# EAGLE design Minimal_carrier_board_for_CM4_rev_A (EAGLE 9.6.2)
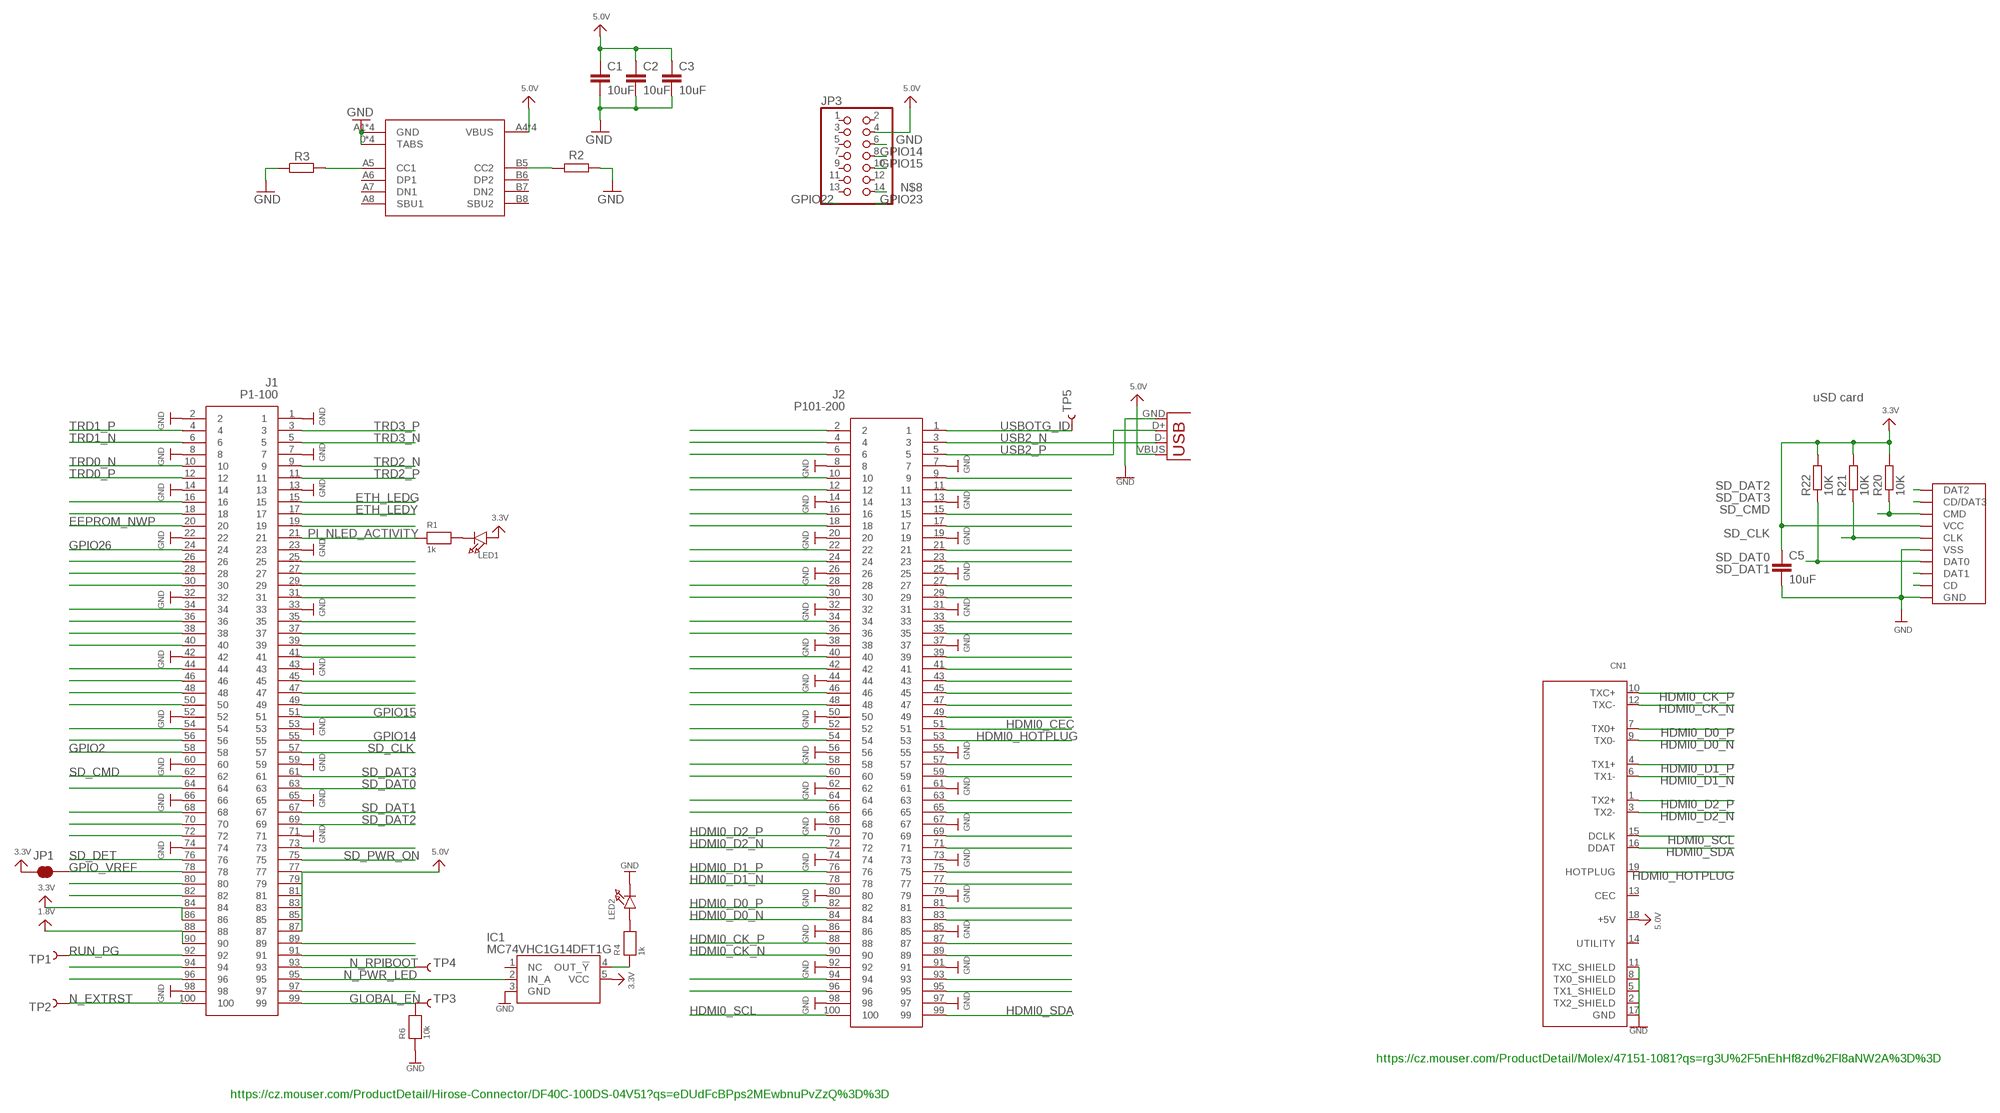
[diagram p0: schematic, sheet 1]

## Parts
C1  10uF  C-EUC0805  [C0805]
C2  10uF  C-EUC0805  [C0805]
C3  10uF  C-EUC0805  [C0805]
C5  10uF  C-EUC0805  [C0805]
CN1  HDMI_MOLEX_47151-0001  [HDMI_MOLEX_47151-0001]
IC1  MC74VHC1G14DFT1G  [SOT65P210X110-5N]
J1  P1-100  DF40C-100DS-0.4V_51_  [DF40C100DS04V51]
J2  P101-200  DF40C-100DS-0.4V_51_  [DF40C100DS04V51]
JP1  JUMPER-SMT_2_NC_TRACE_NO-SILK  [SMT-JUMPER_2_NC_TRACE_NO-SILK]
JP3  PINHD-2X7  [2X07]
LED1  LED0805_NOOUTLINE  [CHIPLED_0805_NOOUTLINE]
LED2  LED0805_NOOUTLINE  [CHIPLED_0805_NOOUTLINE]
R1  1k  RESISTOR_0805MP  [_0805MP]
R2  5.1k  R-EU_R0805  [R0805]
R3  5.1k  R-EU_R0805  [R0805]
R4  1k  RESISTOR_0805MP  [_0805MP]
R6  10k  RESISTOR_0805MP  [_0805MP]
R20  10K  R-EU_R0805  [R0805]
R21  10K  R-EU_R0805  [R0805]
R22  10K  R-EU_R0805  [R0805]
SD_CARD  MICRO_SD_CARD_  [TFP09-2--12B]
TP1  TEST-POINT3X5  [PAD.03X.05]
TP2  TEST-POINT3X5  [PAD.03X.05]
TP3  TEST-POINT3X5  [PAD.03X.05]
TP4  TEST-POINT3X5  [PAD.03X.05]
TP5  TEST-POINT3X5  [PAD.03X.05]
U$59  TYPE-C-31-M-12  [USB-TYPE-C_16PIN-MALE-TYPE-C-31-M-12]
USB2  USBA-PTH  [USB-A-F-PTH]

## Nets
1.8V: J1.88 J1.90
3.3V: C5.1 IC1.5(VCC) J1.84 J1.86 JP1.1 LED1.A R20.2 R21.2 R22.2 SD_CARD.VCC
5.0V: C1.1 C2.1 C3.1 CN1.18(+5V) J1.77 J1.79 J1.81 J1.83 J1.85 J1.87 JP3.4 U$59.A4(VBUS) U$59.A9(VBUS) U$59.B4(VBUS) U$59.B9(VBUS) USB2.VBUS
A0/CC2: R3.2 U$59.A5(CC1)
A3/CC1: R2.1 U$59.B5(CC2)
EEPROM_NWP: J1.20
ETH_LEDG: J1.15
ETH_LEDY: J1.17
GLOBAL_EN: J1.99 R6.2 TP3.P$1
GND: C1.2 C2.2 C3.2 C5.2 CN1.2(TX2_SHIELD) CN1.5(TX1_SHIELD) CN1.8(TX0_SHIELD) CN1.11(TXC_SHIELD) CN1.17(GND) IC1.3(GND) J1.1 J1.2 J1.7 J1.8 J1.13 J1.14 J1.22 J1.23 J1.32 J1.33 J1.42 J1.43 J1.52 J1.53 J1.59 J1.60 J1.65 J1.66 J1.71 J1.74 J1.98 J2.7 J2.8 J2.13 J2.14 J2.19 J2.20 J2.25 J2.26 J2.31 J2.32 J2.37 J2.38 J2.44 J2.50 J2.55 J2.56 J2.61 J2.62 J2.67 J2.68 J2.73 J2.74 J2.79 J2.80 J2.85 J2.86 J2.91 J2.92 J2.97 J2.98 JP3.6 LED2.C R2.2 R3.1 R6.1 SD_CARD.GND SD_CARD.GND@1(GND) SD_CARD.GND@2(GND) SD_CARD.GND@3(VSS) SD_CARD.VSS(GND) U$59.0(TABS) U$59.0-1(TABS) U$59.0-2(TABS) U$59.0-3(TABS) U$59.A1(GND) U$59.A12(GND) U$59.B1(GND) U$59.B12(GND) USB2.GND
GPIO2: J1.58
GPIO14: J1.55 JP3.8
GPIO15: J1.51 JP3.10
GPIO26: J1.24
GPIO_VREF: J1.78 JP1.2
HDMI0_CEC: J2.51
HDMI0_CK_N [diff_pairs]: CN1.12(TXC-) J2.90
HDMI0_CK_P [diff_pairs]: CN1.10(TXC+) J2.88
HDMI0_D0_N [diff_pairs]: CN1.9(TX0-) J2.84
HDMI0_D0_P [diff_pairs]: CN1.7(TX0+) J2.82
HDMI0_D1_N [diff_pairs]: CN1.6(TX1-) J2.78
HDMI0_D1_P [diff_pairs]: CN1.4(TX1+) J2.76
HDMI0_D2_N [diff_pairs]: CN1.3(TX2-) J2.72
HDMI0_D2_P [diff_pairs]: CN1.1(TX2+) J2.70
HDMI0_HOTPLUG: CN1.19(HOTPLUG) J2.53
HDMI0_SCL: CN1.15(DCLK) J2.100
HDMI0_SDA: CN1.16(DDAT) J2.99
N$1: LED1.C R1.2
N$3: J2.2
N$4: IC1.4(OUT_!Y) R4.1
N$5: J2.4
N$6: LED2.A R4.2
N$7: J2.6
N$8: JP3.14
N$9: SD_CARD.CD
N$10: J2.9
N$11: J2.10
N$12: J2.11
N$13: J2.12
N$16: J1.16
N$17: J2.15
N$18: J1.18
N$19: J1.19
N$20: J2.16
N$21: J2.17
N$22: J2.18
N$25: J1.25
N$26: J1.26
N$27: J1.27
N$28: J1.28
N$29: J1.29
N$30: J1.30
N$31: J1.31
N$32: J2.21
N$33: J2.22
N$34: J1.34
N$35: J1.35
N$36: J1.36
N$37: J1.37
N$38: J1.38
N$39: J1.39
N$40: J1.40
N$41: J1.41
N$42: J2.23
N$43: J2.24
N$44: J1.44
N$45: J1.45
N$46: J1.46
N$47: J1.47
N$48: J1.48
N$49: J1.49
N$50: J1.50
N$54: J1.54
N$56: J1.56
N$57: J2.27
N$58: J2.28
N$59: J2.29
N$60: J2.30
N$63: J2.33
N$64: J1.64
N$65: J2.34
N$66: J2.35
N$67: J2.36
N$68: J1.68
N$70: J1.70
N$72: J1.72
N$73: J1.73
N$74: J2.39
N$75: J2.40
N$76: J2.41
N$77: J2.42
N$78: J2.43
N$80: J1.80
N$81: J2.45
N$82: J1.82
N$83: J2.46
N$84: J2.47
N$85: J2.48
N$86: J2.49
N$89: J1.89
N$90: J2.52
N$91: J1.91
N$93: J2.54
N$94: J1.94
N$96: J1.96
N$97: J1.97
N$99: J2.57
N$100: J2.58
N$101: J2.59
N$102: J2.60
N$105: J2.63
N$106: J2.64
N$107: J2.65
N$108: J2.66
N$111: J2.69
N$113: J2.71
N$117: J2.75
N$119: J2.77
N$123: J2.81
N$125: J2.83
N$129: J2.87
N$131: J2.89
N$135: J2.93
N$136: J2.94
N$137: J2.95
N$138: J2.96
N_EXTRST: J1.100 TP2.P$1
N_PWR_LED: IC1.2(IN_A) J1.95
N_RPIBOOT: J1.93 TP4.P$1
PI_NLED_ACTIVITY: J1.21 R1.1
RUN_PG: J1.92 TP1.P$1
SD_CLK: J1.57 R21.1 SD_CARD.CLK
SD_CMD: J1.62 R20.1 SD_CARD.CMD
SD_DAT0: J1.63 R22.1 SD_CARD.DAT0
SD_DAT1: J1.67 SD_CARD.DAT1
SD_DAT2: J1.69 SD_CARD.DAT2
SD_DAT3: J1.61 SD_CARD.CD/DAT3
SD_DET: J1.76
SD_PWR_ON: J1.75
TRD0_N: J1.10
TRD0_P: J1.12
TRD1_N: J1.6
TRD1_P: J1.4
TRD2_N: J1.9
TRD2_P: J1.11
TRD3_N: J1.5
TRD3_P: J1.3
USB2_N [diff_pairs]: J2.3 USB2.D-
USB2_P [diff_pairs]: J2.5 USB2.D+
USBOTG_ID: J2.1 TP5.P$1
Unconnected: CN1.13(CEC) CN1.14(UTILITY) IC1.1(NC) JP3.1 JP3.2 JP3.3 JP3.5 JP3.7 JP3.9 JP3.11 JP3.12 JP3.13 U$59.A6(DP1) U$59.A7(DN1) U$59.A8(SBU1) U$59.B6(DP2) U$59.B7(DN2) U$59.B8(SBU2)

## Notes on the sheet
- uSD card
- https://cz.mouser.com/ProductDetail/Molex/47151-1081?qs=rg3U%2F5nEhHf8zd%2FI8aNW2A%3D%3D
- https://cz.mouser.com/ProductDetail/Hirose-Connector/DF40C-100DS-04V51?qs=eDUdFcBPps2MEwbnuPvZzQ%3D%3D

## Power pins joined to a net without a drawn wire
GND: CN1.P$1(GND) CN1.P$2(GND) CN1.P$3(GND) CN1.P$4(GND)

## Library data of the parts
C1-C3 C5 = rcl:C-EU: CAPACITOR, European symbol; SPICEPREFIX: C
CN1 = microbuilder:HDMI_MOLEX_47151-0001
IC1 = SamacSys_Parts:MC74VHC1G14DFT1G: Source: Datasheet <http://www.onsemi.com/pub/Collateral/MC74VHC1G14-D.PDF>; HEIGHT: 1.1mm; MANUFACTURER_NAME: ON Semiconductor; MANUFACTURER_PART_NUMBER: MC74VHC1G14DFT1G; MOUSER_PART_NUMBER: 863-MC74VHC1G14DFT1G; MOUSER_PRICE-STOCK: https://www.mouser.co.uk/ProductDetail/ON-Semiconductor/MC74VHC1G14DFT1G?qs=YOLdObVcOZkl2BbCxsVnXA%3D%3D
J1 J2 = SamacSys_Parts:DF40C-100DS-0.4V_51_: HIROSE(HRS) - DF40C-100DS-0.4V(51) - CONNECTOR, STACKING, RCPT, 100POS, 2ROW Source: Datasheet <https://www.hirose.com/product/en/download_file/key_name/DF40C-100DS-0.4V(51)/category/Drawing (2D)/doc_file_id/46856/?file_category_id=6&item_id=06844033451&is_series=>; DESCRIPTION: HIROSE(HRS) - DF40C-100DS-0.4V(51) - CONNECTOR, STACKING, RCPT, 100POS, 2ROW; HEIGHT: 1.65mm; MANUFACTURER_NAME: Hirose; MANUFACTURER_PART_NUMBER: DF40C-100DS-0.4V(51); MOUSER_PART_NUMBER: 798-DF40C100DS0.4V51; MOUSER_PRICE-STOCK: https://www.mouser.co.uk/ProductDetail/Hirose-Connector/DF40C-100DS-04V51?qs=eDUdFcBPps2MEwbnuPvZzQ%3D%3D
JP1 = SparkFun-Jumpers:JUMPER-SMT_2_NC_TRACE: Normally closed trace jumper This jumper has a trace between two pads so it's normally closed (NC). Use a razor knife to open the connection. For best results follow the IPC guidelines for cutting traces: Cutout at least 0.063 mm (0.005 in). Remove all loose material to clean up the cut area. Seal the cut with an approved epoxy. Reapply solder to reclose the connection.
JP3 = pinhead:PINHD-2X7: PIN HEADER
LED1 LED2 = microbuilder:LED: LED 0603 - 0603 Surface Mount Package 2mA: Green LED - Low Power (3.9mcd, 2ma, 1.7Vf) - Digikey: 475-2709-2-ND Orange LED - Low Power (9.8mcd, 2ma, 1.8Vf) - Digikey: 475-1194-2-ND Red LED - Low Power (5mcd, 2ma, 1.8Vf) - Digikey: 475-1195-2-ND Yellow LED - Low Power (7mcd, 2ma, 1.8Vf) - Digikey: 475-1196-2-ND 5mA: Blue LED - Low Power (17mcd, 5ma, 2.9Vf) - Digikey: LNJ937W8CRACT-ND 0805 - 0805 Surface Mount Package 2mA: Red LED (8.8mcd, 2mA, 1.8Vf, Clear) - Low Power [Digikey: 475-2510-1-ND] Green LED (5mcd, 2mA, 1.8Vf, Clear) - Low Power [Digikey: 475-2730-1-ND] Yellow LED (11.3mcd, 2mA, 1.8Vf, Clear) - Low Power [Digikey: 475-2555-1-ND] 20mA: Red LED (104mcd, 20mA, Diffused) - LS R976 [Digikey: 475-1278-6-ND] Red LED (12mcd, 20mA, 2.0Vf, Clear) - APT2012EC [Digikey: 754-1128-1-ND] Green LED (15mcd, 20mA, 2.2Vf, Clear) - APT2012GC [Digikey: 754-1131-1-ND] Orange LED (160mcd, 20mA, 2.1Vf, Clear) - APT2012SECK [Digikey: 754-1130-1-ND] 1206 - 1206 Surface Mount Package Green LED (26mcd, 20mA, Diffused) - LG N971 [Digikey: 475-1407-6-ND] Red LED (15mcd, 20mA, Diffused) - LH N974 [Digikey: 475-1416-6-ND]
R1 R4 R6 = microbuilder:RESISTOR: Resistors 0402 - 0402 Surface Mount Package 22 Ohm 1% 1/16W [Digikey: 311-22.0LRTR-ND] 33 Ohm 5% 1/16W 1.0K 5% 1/16W 1.5K 5% 1/16W 2.0K 1% 1/16W 10.0K 1% 1/16W [Digikey: 311-10.0KLRTR-ND] 10.0K 5% 1/16W [Digikey: RMCF0402JT10K0TR-ND] 12.1K 1% 1/16W [Digikey: 311-22.0LRTR-ND] 100.0K 5% 1/16W 0603 - 0603 Surface Mount Package 0 Ohm 1/10 Watt 1% Resistor 15 Ohm 1/10 Watt 1% Resistor 33 Ohm 1/10 Watt 1% Resistor 49.9 Ohm 1/10 Watt 1% Resistor 100 Ohm 1/10 Watt 1% Resistor 150 Ohm 1/10 Watt 1% Resistor 240 Ohm 1/10 Watt 1% Resistor 390 Ohm 1/10 Watt 1% Resistor 560 Ohm 1/10 Watt 1% Resistor 680 Ohm 1/10 Watt 1% Resistor 750 Ohm 1/10 Watt 1% Resistor 1.0K Ohm 1/10 Watt 1% Resistor 1.5K Ohm 1/10 Watt 1% Resistor 2.0K Ohm 1/10 Watt 1% Resistor 2.2K Ohm 1/10 Watt 1% Resistor 3.3K Ohm 1/10 Watt 1% Resistor 4.7K Ohm 1/10 Watt 1% Resistor 10.0K Ohm 1/10 Watt 1% Resistor 12.0K Ohm 1/10 Watt 1% Resistor 12.1K Ohm 1/10 Watt 1% Resistor 20.0K Ohm 1/10 Watt 1% Resistor 33.0K Ohm 1/10 Watt 1% Resistor 100.0K Ohm 1/10 Watt 1% Resistor 0805 - 0805 Surface Mount Package 0 Ohm 1/8 Watt 1% Resistor 33 Ohm 1/8 Watt 1% Resistor 100 Ohm 1/8 Watt 1% Resistor 150 Ohm 1/8 Watt 1% Resistor 200 Ohm 1/8 Watt 1% Resistor 240 Ohm 1/8 Watt 1% Resistor 330 Ohm 1/8 Watt 1% Resistor 390 Ohm 1/8 Watt 1% Resistor 470 Ohm 1/8 Watt 1% Resistor 1.0K Ohm 1/8 Watt 1% Resistor 1.5K Ohm 1/8 Watt 1% Resistor 2.0K Ohm 1/8 Watt 1% Resistor 4.7K Ohm 1/8 Watt 1% Resistor 5.1K Ohm 1/8 Watt 1% Resistor 5.6K Ohm 1/8 Watt 1% Resistor 10.0K Ohm 1/8 Watt 1% Resistor 22.0K Ohm 1/8 Watt 1% Resistor 33.0K Ohm 1/8 Watt 1% Resistor 100K Ohm 1/8 Watt 1% Resistor 1206 - 1206 Surface Mount Package 2012 - 2010 Surface Mount Package 0.11 Ohm 1/2 Watt 1% Resistor - Digikey: RHM.11UCT-ND
R2 R3 R20-R22 = rcl:R-EU_: RESISTOR, European symbol; SPICEPREFIX: R
SD_CARD = dronecz:MICRO_SD_CARD
TP1-TP5 = SparkFun-Connectors:TEST-POINT: SparkFun Test Points Bare copper test points for troubleshooting or In-Circuit-Testing. These are used by our Production team for verifying production board runs using pogo-pins on test beds. SparkFun Products: SparkFun LSM9DS1 Breakout <https://www.sparkfun.com/products/13284> SparkFun PSOC <https://www.sparkfun.com/products/13714> SparkFun Load Cell Amplifier <https://www.sparkfun.com/products/13879>
U$59 = Custom-Parts:TYPE-C-31-M-12
USB2 = Ai_Connectors:USB

## Net classes
1 diff_pairs: width 0.152 mm

## Board
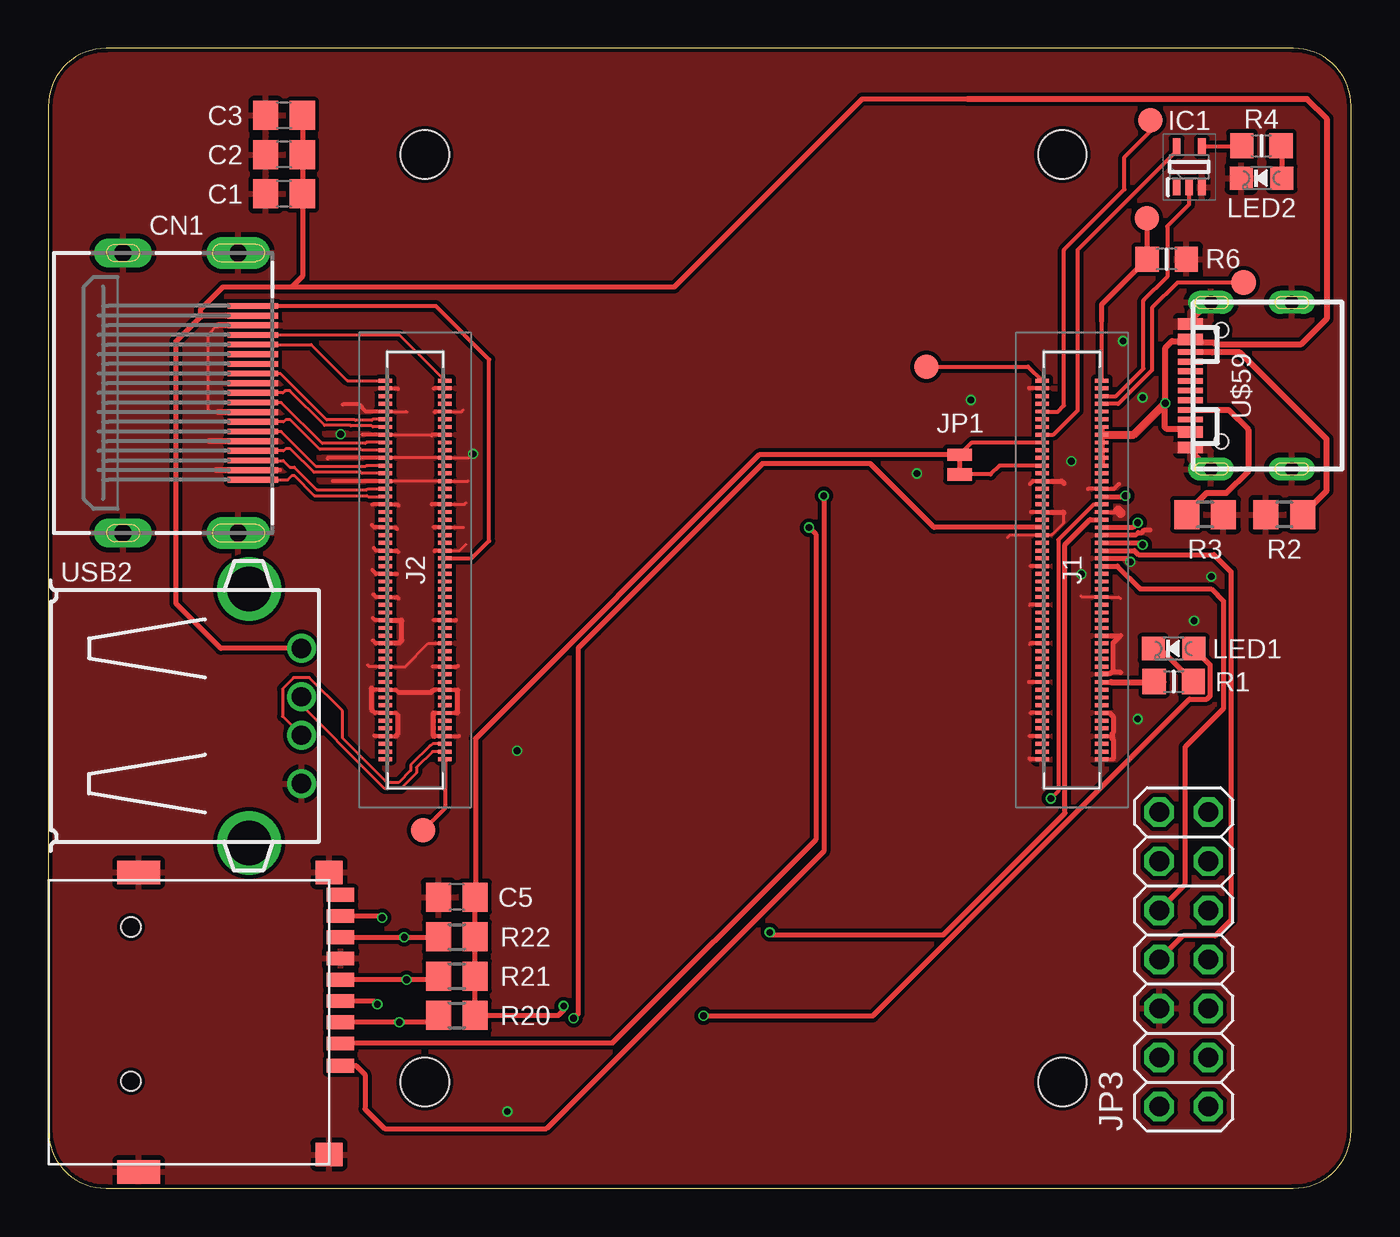
[diagram p1: board, top side]
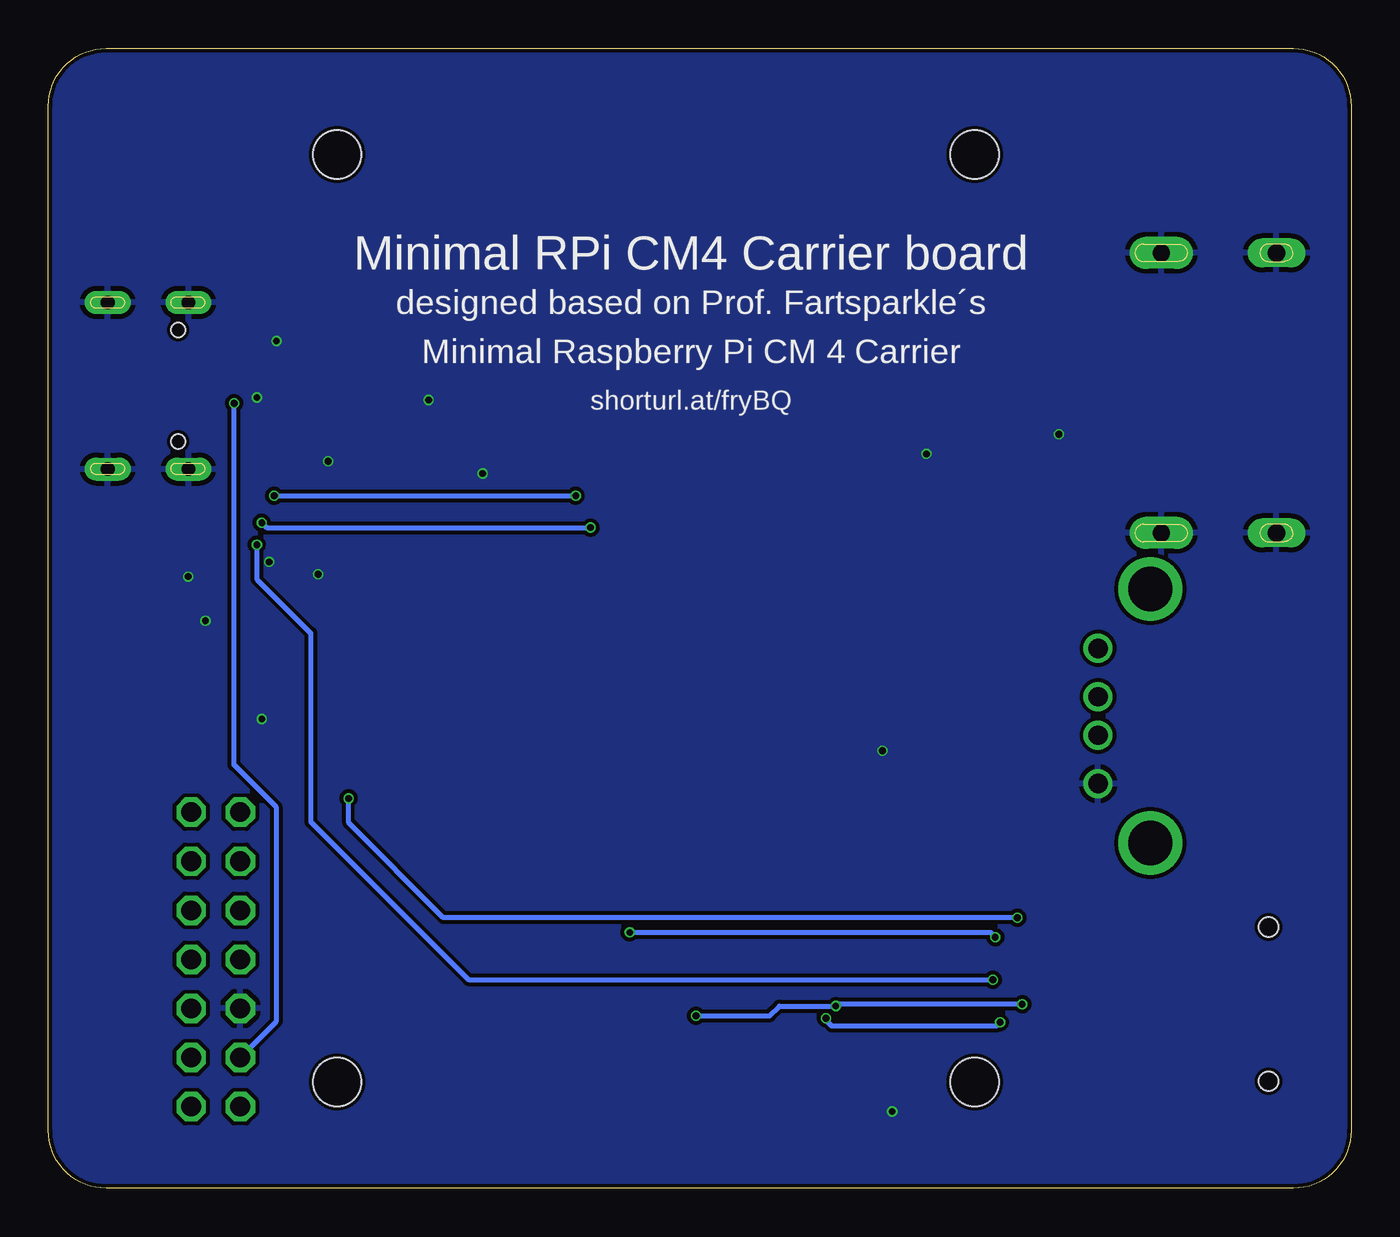
[diagram p2: board, bottom side, seen from below]

Size 67.46 x 59 mm. Coordinates in mm from the lower left corner, seen from the top.
Outline: 64.46,59 3,59 arc90 0,56 0,3 arc90 3,0 64.46,0 arc90 67.46,3 67.46,56 arc90 64.46,59
Copper layers (1*16): Top 0.035559375mm / dielectric 1.6mm / Bottom 0.035559375mm
Design rules "jlcpcb2layer": minimum track width 5mil, minimum drill 12mil, track to track 5mil, track to pad 5mil, pad to pad 5mil, via to via 5mil, smd to smd 5mil, copper to edge 8mil, drill to drill 6mil, minimum pad ring 5mil, minimum via ring 3mil, stop-mask expansion 2.5mil, vias tented up to drill 0mil, thermal gap 10mil
Holes 2.5 mm at 19.5,53.5 52.5,53.5 19.5,5.5 52.5,5.5

### Footprints (pad centres in the part's own frame; a part is rotated, then mirrored left to right if it is on the bottom)
C0805 = smd 1.3 x 1.5: 1 -0.95,0; 2 0.95,0
HDMI_MOLEX_47151-0001 = smd 0.3 x 2.6: 1 4.5,0; 2 4,0; 3 3.5,0; 4 3,0; 5 2.5,0; 6 2,0; 7 1.5,0; 8 1,0; 9 0.5,0; 10 0,0; 11 -0.5,0; 12 -1,0; 13 -1.5,0; 14 -2,0; 15 -2.5,0; 16 -3,0; 17 -3.5,0; 18 -4,0; 19 -4.5,0 | drill 0.9 pad 1.65 long: P$1 -7.25,-0.76; P$2 7.25,-0.76 | drill 0.9 pad 1.5 long: P$3 7.25,-6.72; P$4 -7.25,-6.72
SOT65P210X110-5N = smd 0.85 x 0.4: 1 -1.05,0.65; 2 -1.05,0; 3 -1.05,-0.65; 4 1.05,-0.65; 5 1.05,0.65
DF40C100DS04V51 = smd 0.2 x 0.7: 1 -9.8,-1.54; 2 -9.8,1.54; 3 -9.4,-1.54; 4 -9.4,1.54; 5 -9,-1.54; 6 -9,1.54; 7 -8.6,-1.54; 8 -8.6,1.54; 9 -8.2,-1.54; 10 -8.2,1.54; 11 -7.8,-1.54; 12 -7.8,1.54; 13 -7.4,-1.54; 14 -7.4,1.54; 15 -7,-1.54; 16 -7,1.54; 17 -6.6,-1.54; 18 -6.6,1.54; 19 -6.2,-1.54; 20 -6.2,1.54; 21 -5.8,-1.54; 22 -5.8,1.54; 23 -5.4,-1.54; 24 -5.4,1.54; 25 -5,-1.54; 26 -5,1.54; 27 -4.6,-1.54; 28 -4.6,1.54; 29 -4.2,-1.54; 30 -4.2,1.54; 31 -3.8,-1.54; 32 -3.8,1.54; 33 -3.4,-1.54; 34 -3.4,1.54; 35 -3,-1.54; 36 -3,1.54; 37 -2.6,-1.54; 38 -2.6,1.54; 39 -2.2,-1.54; 40 -2.2,1.54; 41 -1.8,-1.54; 42 -1.8,1.54; 43 -1.4,-1.54; 44 -1.4,1.54; 45 -1,-1.54; 46 -1,1.54; 47 -0.6,-1.54; 48 -0.6,1.54; 49 -0.2,-1.54; 50 -0.2,1.54; 51 0.2,-1.54; 52 0.2,1.54; 53 0.6,-1.54; 54 0.6,1.54; 55 1,-1.54; 56 1,1.54; 57 1.4,-1.54; 58 1.4,1.54; 59 1.8,-1.54; 60 1.8,1.54; 61 2.2,-1.54; 62 2.2,1.54; 63 2.6,-1.54; 64 2.6,1.54; 65 3,-1.54; 66 3,1.54; 67 3.4,-1.54; 68 3.4,1.54; 69 3.8,-1.54; 70 3.8,1.54; 71 4.2,-1.54; 72 4.2,1.54; 73 4.6,-1.54; 74 4.6,1.54; 75 5,-1.54; 76 5,1.54; 77 5.4,-1.54; 78 5.4,1.54; 79 5.8,-1.54; 80 5.8,1.54; 81 6.2,-1.54; 82 6.2,1.54; 83 6.6,-1.54; 84 6.6,1.54; 85 7,-1.54; 86 7,1.54; 87 7.4,-1.54; 88 7.4,1.54; 89 7.8,-1.54; 90 7.8,1.54; 91 8.2,-1.54; 92 8.2,1.54; 93 8.6,-1.54; 94 8.6,1.54; 95 9,-1.54; 96 9,1.54; 97 9.4,-1.54; 98 9.4,1.54; 99 9.8,-1.54; 100 9.8,1.54
SMT-JUMPER_2_NC_TRACE_NO-SILK = smd 0.635 x 1.27: 1 -0.508,0; 2 0.508,0
2X07 = drill 1.016 octagon: 1 -7.62,-1.27; 2 -7.62,1.27; 3 -5.08,-1.27; 4 -5.08,1.27; 5 -2.54,-1.27; 6 -2.54,1.27; 7 0,-1.27; 8 0,1.27; 9 2.54,-1.27; 10 2.54,1.27; 11 5.08,-1.27; 12 5.08,1.27; 13 7.62,-1.27; 14 7.62,1.27
CHIPLED_0805_NOOUTLINE = smd 1.2 x 1.2: A 0,-1.05; C 0,1.05
_0805MP = smd 1.2 x 1.3: 1 -1.016,0; 2 1.016,0
R0805 = smd 1.3 x 1.5: 1 -0.95,0; 2 0.95,0
TFP09-2--12B = smd 0.711 x 1.422: CD -6.6,7.85; CD/DAT3 1.1,7.85; CLK -2.2,7.85; CMD 0,7.85; DAT0 -4.4,7.85; DAT1 -5.5,7.85; DAT2 2.25,7.85; VCC -1.1,7.85; VSS -3.3,7.85 | smd 1.2 x 2.2: GND -7.75,-2.6; GND@1 7.75,-2.6 | smd 1.2 x 1.4: GND@2 -7.75,7.25; GND@3 6.85,7.25 | hole 1: -4.93,-3; 3.05,-3
PAD.03X.05 = smd 1.27 x 1.27: P$1 0,0
USB-TYPE-C_16PIN-MALE-TYPE-C-31-M-12 = drill 0.7 pad 1.2 long: 0 -4.32,1.556; 0-1 4.32,1.556; 0-2 4.32,-2.624; 0-3 -4.32,-2.624 | smd 0.3 x 1.3: A1 -3.35,2.623; A4 -2.55,2.623; A5 -1.25,2.623; A6 -0.25,2.623; A7 0.25,2.623; A8 1.25,2.624; A9 2.55,2.623; A12 3.35,2.623; B1 3.05,2.623; B4 2.25,2.623; B5 1.75,2.623; B6 0.75,2.623; B7 -0.75,2.623; B8 -1.75,2.624; B9 -2.25,2.623; B12 -3.05,2.623 | hole 0.75: 2.89,1.026; -2.89,1.026
USB-A-F-PTH = drill 1: D+ 1,5.37; D- -1,5.37; GND 3.5,5.37; VBUS -3.5,5.37 | drill 2.286: P$1 -6.57,2.66; P$2 6.57,2.66

### Placement (x,y rotation side)
C1  12.21,51.47 180 top
C2  12.21,53.5 180 top
C3  12.21,55.53 180 top
C5  21.15,15.07 180 top
CN1  10.59,41.16 270 top
IC1  59.07,52.87 90 top
J1  53,32 90 top
J2  19,32 90 top
JP1  47.18,37.45 270 top
JP3  58.79,11.84 90 top
LED1  58.26,27.93 90 top
LED2  62.81,52.28 90 top
R1  58.27,26.23 0 top
R2  64,34.87 180 top
R3  59.89,34.87 180 top
R4  62.81,53.96 0 top
R6  57.9,48.09 180 top
R20  21.15,8.95 0 top
R21  21.15,10.98 0 top
R22  21.15,13.01 0 top
SD_CARD  7.28,8.59 270 top
TP1  57.06,55.27 0 top
TP2  45.47,42.53 0 top
TP3  56.88,50.2 0 top
TP4  61.89,46.88 0 top
TP5  19.4,18.54 0 top
U$59  61.76,41.53 90 top
USB2  7.74,24.44 270 top

### Tracks (layer width: path | path; a pad name or v marks a point on that pad's centre or on a via)
1.8V
  Top 0.152: J1.90 J1.88
3.3V  (via drill 0.35)
  Top 0.152: J1.86 J1.84
  Top 0.203: JP1.1 47.82,38.6 J1.84 | J1.86 52.04,39 53.31,40.27 53.31,48.57 58.42,53.69 IC1.5
  Top 0.254: SD_CARD.VCC 16.87,9.69 v17.04,9.53 | v26.69,9.43 26.69,9.22 26.42,8.95 R20.2 R21.2 R22.2 22.1,14.89 | 22.1,14.89 C5.1 | JP1.1 36.8,37.96 22.11,23.27 22.11,14.91 22.1,14.89 | LED1.A 60.14,27.1 60.14,25.47 59.99,25.32 59.09,25.32 42.69,8.92 v33.93,8.92
  Bottom 0.254: v17.04,9.53 26.59,9.53 v26.69,9.43 29.61,9.43 30.12,8.92 v33.93,8.92
5.0V  (via drill 0.35)
  Top 0.152: 54.54,39.28 J1.85 J1.83 J1.81 54.54,38.01 | U$59.B9 U$59.A4 | U$59.A9 U$59.B4
  Top 0.203: J1.77 54.54,37.5 | 54.54,39.28 J1.87
  Top 0.254: 47.59,56.37 42.13,56.37 32.4,46.64 12.59,46.64 | 12.59,46.64 9.03,46.64 7.87,45.48 7.87,45.09 6.62,43.84 6.62,30.26 8.94,27.94 USB2.VBUS | C3.1 C2.1 C1.1 13.16,47.21 12.59,46.64 | U$59.B4 59.33,43.78
  Top 0.305: CN1.18 7.94,45.16 7.87,45.09 | 47.59,56.37 65.17,56.37 66.18,55.35 66.18,44.99 64.89,43.69 60.43,43.69 60.34,43.78 U$59.B4 | 54.54,39.28 54.54,38.01 J1.79 54.54,37.5 | 59.33,43.78 59.26,43.85 58.18,43.85 57.84,43.51 v57.84,40.63 57.8,40.6 57.8,39.4 57.92,39.28 U$59.B9
  Top 0.406: J1.85 56.2,39 v57.84,40.63
  Bottom 0.254: JP3.4 55.64,8.64 55.64,19.72 57.84,21.91 v57.84,40.63
A0/CC2
  Top 0.305: U$59.A5 59.14,40.29 61.1,40.29 62.12,39.28 62.12,37.12 60.98,35.97 59.96,35.97 58.94,34.95 R3.2
A3/CC1
  Top 0.305: U$59.B5 60.23,43.28 60.25,43.26 61.69,43.26 66.18,38.77 66.18,36.1 R2.1
GLOBAL_EN
  Top 0.203: J1.99 54.54,44.88
  Top 0.254: 54.54,44.88 54.54,45.74 R6.2 TP3.P$1
GND  (via drill 0.35)
  Top 0.152: 50.88,35 50.87,34.98 | 50.85,32.2 50.84,32.19 | 50.86,30.2 50.82,30.16 | 50.87,28.2 50.82,28.15 | 49.67,33.69 49.79,33.8 J1.60 51.48,33.81 51.96,33.81 52.59,34.45 52.59,34.96 | 16.53,27.08 16.61,27 J2.26 18.48,27 19.68,28.2 J2.31 | J2.61 21.48,34.2 | J2.55 21.3,33 21.61,33.31 | 21.73,36.61 21.73,36.6 J2.73 J2.74 | J2.67 21.54,35.4 21.61,35.47 | J2.91 21.39,40.2 21.48,40.29 | J2.86 19.88,39 | J2.92 18.52,40.2 18.56,40.16 | 8.78,40.16 8.42,40.16 8.27,40.32 8.27,41.82 | 8.75,44.66 8.27,44.18 8.27,41.82 | CN1.11 8.78,41.66 8.42,41.66 8.27,41.82 | J2.80 J2.79 21.78,37.8 v21.99,38.01 | 53.48,30.64 53.52,30.6 J1.43 55.43,30.6 55.52,30.51
  Top 0.2: J2.91 20.04,40.2 | J2.85 19.88,39 | J2.67 19.87,35.4 19.85,35.41
  Top 0.203: 55.44,36.46 55.18,36.2 J1.71 53.84,36.2 | J1.66 50.88,35 | J1.52 50.85,32.2 | J1.42 50.86,30.2 | J1.32 50.87,28.2 | J1.22 50.8,26.2 50.79,26.2 | J1.74 50.99,36.6 50.84,36.46 | J1.98 50.8,41.4 50.79,41.41 | J1.14 50.87,24.6 50.87,24.59 | J1.8 50.82,23.4 | J1.2 50.85,22.2 50.82,22.23 | 21.1,29.4 21.09,29.4 J2.37 19.98,29.4 19.96,29.42 | J2.31 | 18.13,30.51 18.04,30.6 J2.44 16.97,30.6 16.83,30.74 | 18.05,31.78 18.03,31.8 J2.50 16.97,31.8 16.78,31.99 | 18.13,32.93 18.05,33 J2.56 16.99,33 16.86,33.13 | 18.05,34.12 17.97,34.2 J2.62 16.88,34.2 16.76,34.32 | 18.13,35.34 18.07,35.4 J2.68 16.79,35.4 16.78,35.39 | J2.61 19.98,34.2 19.96,34.22 | J2.55 20,33 19.98,32.98 | J2.98 18.06,41.4 18.1,41.36 | J2.80 14.49,37.8 14.47,37.78 | J2.86 16.3,39 | J2.92 16.47,40.2 16.09,40.57 15.26,40.57 | J2.74 14.73,36.6 | 11.98,37.17 CN1.2 | J1.1 55.1,22.2 55.11,22.21 | J1.7 55.08,23.4 55.11,23.38 | J2.97 19.97,41.4 19.96,41.38 | 20.04,40.2 20.01,40.16 | 19.88,39 19.85,38.97 | 19.96,25.79 19.97,25.8 J2.19 21.19,25.8 21.2,25.79 | 21.18,24.59 21.17,24.6 J2.13 19.93,24.59 | 21.25,23.4 J2.7 20.01,23.4 19.98,23.38 | 18,23.38 17.98,23.4 J2.8 16.91,23.4 16.88,23.43 | 16.81,24.7 16.9,24.6 J2.14 18,24.6 18.1,24.49 | 16.73,25.92 16.74,25.9 16.85,25.8 J2.20 18.01,25.8 18.15,25.66 | J2.32 16.96,28.2 16.81,28.35 | J2.38 16.93,29.4 16.81,29.52 | 19.91,27.01 19.91,27 J2.25 21.17,27 21.2,27.03 | J1.65 55.3,35 55.39,35.09
  Top 0.254: J1.59 54.55,33.81 56.31,33.81 56.43,33.93 56.62,33.93 56.75,34.07 57.04,34.07 | J1.53 55.84,32.6 v56.02,32.42 | J1.33 55.51,28.6 | 55.51,28.6 55.52,28.61 | 55.11,22.21 55.14,22.24 55.14,23.2 55.08,23.26 55.08,23.4 55.08,23.54 55.14,23.59 55.14,24.41 54.95,24.6 J1.13 | J1.66 52.55,35 52.59,34.96 | J1.74 52.48,36.6 52.59,36.48 | J1.23 54.59,26.65 54.99,26.65 55.05,26.7 | 55.52,26.7 55.05,26.7 | 55.05,26.7 55.14,26.8 55.14,28.24 55.51,28.6 | 17.98,23.4 18.1,23.53 18.1,24.49 | 16.81,24.7 16.74,24.76 16.74,25.9 | 18.15,25.66 19.83,25.66 19.96,25.79 | 19.93,24.59 19.93,23.43 19.98,23.38 | 21.17,24.6 21.2,24.63 21.2,25.79 | J2.32 17.49,28.23 18.18,28.23 18.3,28.35 18.3,29.37 18.27,29.4 J2.38 | U$59.A12 60.11,45.85 U$59.0-1 | U$59.A1 60.11,37.21 U$59.0
  Top 0.305: CN1.5 8.35,38.67 | CN1.2 8.7,37.17 | CN1.8 8.78,40.16 | CN1.17 8.76,44.66 8.75,44.66
  Top 0.508: 55.39,35.09 55.52,34.96
  other vias: 15.13,39.02 55.64,43.85 60.22,31.66 59.33,29.37 23.77,3.97 56.66,40.93 24.27,22.64 56.41,24.29 53.48,31.78 52.98,37.62 44.98,36.99 47.77,40.8
  pour Top (isolate 0.203): -1.78,60.28 71.04,60.28 71.04,-1.66 -1.78,-1.66
  pour Bottom (isolate 0.203): -4.06,62.82 72.19,62.82 72.19,-2.55 -4.06,-2.55
GPIO14
  Top 0.254: J1.55 56.24,33 56.44,32.79 60.35,32.79 61.23,31.91 61.23,13.88 60.41,13.06 58.74,13.06 JP3.8
GPIO15
  Top 0.254: J1.51 55.35,32.2 56.53,31.02 60.22,31.02 60.85,30.39 60.85,24.82 58.87,22.84 58.87,15.73 JP3.10
GPIO_VREF
  Top 0.152: JP1.2 47.59,36.94
  Top 0.203: J1.78 49.25,37.4 48.79,36.94 47.59,36.94
HDMI0_CK_N
  Top 0.152: J2.90 16.8,39.8 16.75,39.74 15.89,39.74 15.86,39.77 14.42,39.77 12.02,42.16 CN1.12
HDMI0_CK_P
  Top 0.152: J2.88 16.8,39.4 16.75,39.46 15.68,39.46 15.65,39.49 14.3,39.49 12.51,41.29 12.26,41.29 12.14,41.16 CN1.10
HDMI0_D0_N
  Top 0.152: CN1.9 12.07,40.66 14.18,38.55 16.42,38.55 16.47,38.6 J2.84
HDMI0_D0_P
  Top 0.152: CN1.7 12.18,39.66 12.3,39.78 12.52,39.78 14.05,38.25 16.18,38.25 16.23,38.2 J2.82
HDMI0_D1_N
  Top 0.152: CN1.6 12.07,39.16 13.88,37.35 16.42,37.35 16.47,37.4 J2.78
HDMI0_D1_P
  Top 0.152: CN1.4 12.18,38.16 12.3,38.28 12.52,38.28 13.75,37.05 16.18,37.05 16.23,37 J2.76
HDMI0_D2_N
  Top 0.152: J2.72 16.54,36.2 16.5,36.15 13.9,36.15 12.74,37.32 12.51,37.32 12.16,37.66 CN1.3
HDMI0_D2_P
  Top 0.152: J2.70 16.55,35.8 16.5,35.85 13.78,35.85 12.73,36.89 12.62,36.89 12.39,36.66 CN1.1
HDMI0_HOTPLUG
  Top 0.203: CN1.19 20.04,45.66 22.83,42.88 22.83,33.51 21.92,32.6 J2.53
HDMI0_SCL
  Top 0.152: CN1.15 13.61,43.66 15.48,41.8 J2.100
HDMI0_SDA
  Top 0.152: CN1.16 18.18,44.16 J2.99
N$1
  Top 0.254: LED1.C 57.58,27.93 R1.2
N$4
  Top 0.203: R4.1 61.75,53.91 IC1.4
N$6
  Top 0.254: R4.2 63.86,53.92 LED2.A
N_EXTRST
  Top 0.203: TP2.P$1 50.73,42.53 J1.100
N_PWR_LED
  Top 0.203: J1.95 55.28,41 56.71,42.43 56.71,45.96 57.93,47.17 57.93,49.78 59.07,50.93 IC1.2
N_RPIBOOT
  Top 0.203: J1.93 55.39,40.6 57.14,42.35 57.14,45.56 58.46,46.88 TP4.P$1
PI_NLED_ACTIVITY
  Top 0.254: J1.21 55.02,26.2
  Top 0.305: R1.1 57.74,26.2 55.02,26.2
RUN_PG
  Top 0.203: J1.92 52.27,40.2 52.59,40.52 52.59,48.57 55.72,51.7 55.72,53.37 57.06,54.71 TP1.P$1
SD_CLK  (via drill 0.35)
  Top 0.254: R21.1 20.01,10.79 v18.56,10.79 SD_CARD.CLK | J1.57 56.57,33.4 v56.66,33.31
  Bottom 0.254: v56.66,33.31 56.66,31.53 53.87,28.73 53.87,18.96 45.7,10.79 v18.56,10.79
SD_CMD  (via drill 0.35)
  Top 0.254: SD_CARD.CMD v18.18,8.59 19.84,8.59 R20.1 | J1.62 45.86,34.2 42.56,37.5 36.97,37.5 28.34,28.86 27.45,27.97 27.45,9.05 v27.2,8.8
  Bottom 0.254: v27.2,8.8 27.2,8.7 26.9,8.41 18.36,8.41 v18.18,8.59
SD_DAT0  (via drill 0.35)
  Top 0.254: J1.63 53.94,34.6 52.65,33.31 52.65,19.42 51.56,18.34 46.34,13.11 37.35,13.11 v37.35,13.24 | SD_CARD.DAT0 v18.43,12.99 20.18,12.99 R22.1
  Bottom 0.254: v37.35,13.24 18.68,13.24 v18.43,12.99
SD_DAT1  (via drill 0.35)
  Top 0.203: J1.67 54.13,35.4 52.29,33.56 52.29,20.56 v51.91,20.18
  Top 0.254: SD_CARD.DAT1 17.2,14.09 v17.29,14
  Bottom 0.254: v17.29,14 47.01,14 51.91,18.91 v51.91,20.18
SD_DAT2  (via drill 0.35)
  Top 0.254: SD_CARD.DAT2 15.93,6.34 16.4,5.88 16.4,4.1 17.42,3.08 25.8,3.08 40.15,17.43 v40.15,35.85 | J1.69 55.72,35.8 v55.77,35.85
  Bottom 0.254: v55.77,35.85 v40.15,35.85
SD_DAT3  (via drill 0.35)
  Top 0.254: SD_CARD.CD/DAT3 15.16,7.53 29.23,7.53 39.77,18.07 39.77,33.81 v39.39,34.2 | J1.61 56.15,34.2 v56.41,34.45
  Bottom 0.254: v56.41,34.45 56.15,34.2 v39.39,34.2
USB2_N
  Top 0.152: J2.3 19.89,22.6 19.07,21.78 19.07,21.5 18.25,20.68 17.42,20.68 16.8,21.3 | USB2.D- 13.11,24.99 16.8,21.3 | 16.8,21.3
USB2_P
  Top 0.152: J2.5 19.89,23 19.79,22.91 19.76,22.91 18.76,21.91 18.76,21.62 18.13,20.99 17.54,20.99 | USB2.D+ 12.13,24.42 12.13,25.85 12.7,26.42 13.52,26.42 15.23,24.71 15.23,23.3 17.54,20.99 | 17.54,20.99
USBOTG_ID
  Top 0.203: J2.1 20.54,19.67 TP5.P$1

### Text on the board
bPlace: Minimal RPi CM4 Carrier board | designed based on Prof. Fartsparkle´s | Minimal Raspberry Pi CM 4 Carrier | shorturl.at/fryBQ